# Altium schematic sheet Sheet2.SchDoc
size A4; SheetNumber: 3; SheetTotal: 5
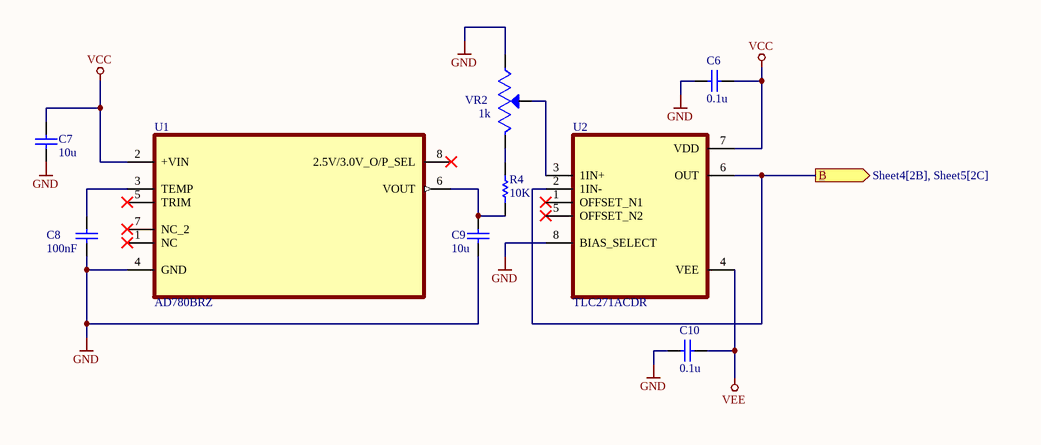
[diagram p0: Sheet2.SchDoc]

## Parts
C6  value 0.1u  [CAPC2012X150N]  (hidden comment: Capacitor)
C7  value 10u  [CAPC2012X150N]  (hidden comment: Capacitor)
C8  value 100nF  [CAPC2012X150N]  (hidden comment: Capacitor)
C9  value 10u  [CAPC2012X150N]  (hidden comment: Capacitor)
C10  value 0.1u  [CAPC2012X150N]  (hidden comment: Capacitor)
R4  value 10K  [RES_ERA6AHD330V]  (hidden comment: Resistor)
U1  AD780BRZ  [SOIC127P600X175-8N]
U2  TLC271ACDR  [SOIC127P599X175-8N]
VR2  1k  [TRIM_3296W-1-103RLF]

## Ports
B (out, see Sheet4[2B], Sheet5[2C])

## Nets
GND: C6.2 C7.1 C8.1 C9.1 C10.2 U1.4(GND) U2.8(BIAS_SELECT) VR2.1(CCW)
VCC: C6.1 C7.2 U1.2(+VIN) U2.7(VDD)
VEE: C10.1 U2.4(VEE)
B: U2.2(1IN-) U2.6(OUT) ; port B
NetC8_2: C8.2 U1.3(TEMP)
NetC9_2: C9.2 R4.1 U1.6(VOUT)
NetR4_2: R4.2 VR2.3(CW)
NetU2_3: U2.3(1IN+) VR2.2(WIPER)

Not connected (* = marked no-connect by the designer): U1 1(NC)* 5(TRIM)* 7(NC_2)* 8(2.5V/3.0V_O/P_SEL)*; U2 1(OFFSET_N1)* 5(OFFSET_N2)*

## Library data of the parts
C6-C10 = Capacitor: SimulationGenericComponent: True
R4 = Resistor: TC1: 0; SimulationGenericComponent: True; TC2: 0
U1 = AD780BRZ: 2.5 V/3.0 V High Precision Reference; MF: Analog Devices; SnapEDA_Link: https://www.snapeda.com/parts/AD780BRZ/Analog+Devices/view-part/?ref=snap; Package: SOIC-8 Analog Devices; Value: *; MP: AD780BRZ; Check_prices: https://www.snapeda.com/parts/AD780BRZ/Analog+Devices/view-part/?ref=eda
U2 = TLC271ACDR: Single, 16-V, 2-MHz, 5-mV offset voltage, In to V- operational amplifier; MF: Texas Instruments; SnapEDA_Link: https://www.snapeda.com/parts/TLC271ACDR/Texas+Instruments/view-part/?ref=snap; Package: SOIC-8 Texas Instruments; Value: *; MP: TLC271ACDR; Check_prices: https://www.snapeda.com/parts/TLC271ACDR/Texas+Instruments/view-part/?ref=eda
VR2 = 3296W-1-103RLF: Trimmer, Cermet, Rest 10 Kilohms, PCB, 25 Turns, Pwr-Rtg 0.5W | Bourns 3296W-1-103RLF; SnapEDA_Link: https://www.snapeda.com/parts/3296W-1-103RLF/Bourns/view-part/?ref=snap; Package: NON STANDARD-3 Bourns; Value: *; MF: Bourns; MP: 3296W-1-103RLF; Check_prices: https://www.snapeda.com/parts/3296W-1-103RLF/Bourns/view-part/?ref=eda